# EAGLE design SC16IS740v4 (EAGLE 7.3.0)
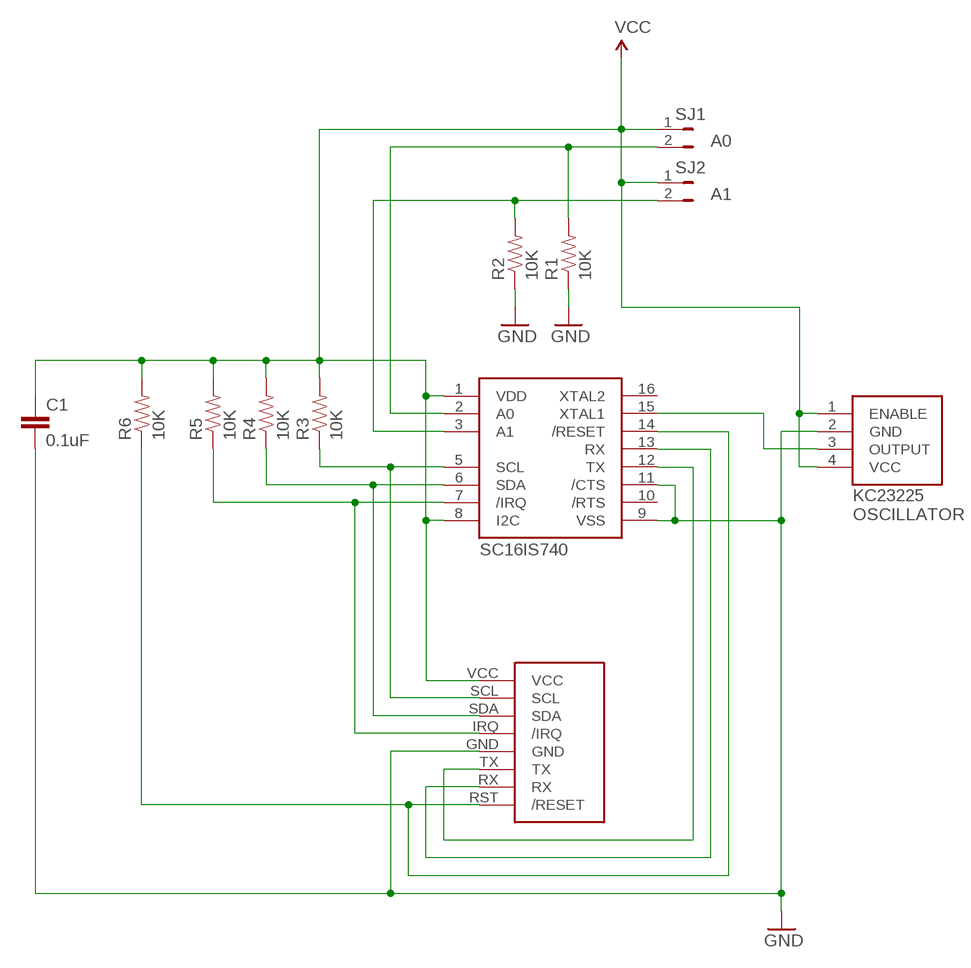
[diagram p0: schematic, sheet 1]

## Parts
C1  0.1uF  0.1UF-25V-5%(0603)  [0603-CAP]
R1  10K  10KOHM-1/10W-1%(0603)0603  [0603-RES]
R2  10K  10KOHM-1/10W-1%(0603)0603  [0603-RES]
R3  10K  10KOHM-1/10W-1%(0603)0603  [0603-RES]
R4  10K  10KOHM-1/10W-1%(0603)0603  [0603-RES]
R5  10K  10KOHM-1/10W-1%(0603)0603  [0603-RES]
R6  10K  10KOHM-1/10W-1%(0603)0603  [0603-RES]
SJ1  JUMPER-PTH-2-NO  [PTH-JUMPER-2-NO_NO_SILK]
SJ2  JUMPER-PTH-2-NO  [PTH-JUMPER-2-NO_NO_SILK]
U$1  SC16IS740  [SC16IS740]
U$2  HEADER-SC16IS740-NOFLOW  [HEADER-SC16IS740-NOFLOW]
U$3  OSC-KC3225K  [OSC-KC3225K]

## Nets
/IRQ: R5.1 U$1.7(/IRQ) U$2.IRQ(/IRQ)
/RESET: R6.1 U$1.14(/RESET) U$2.RST(/RESET)
A0: R1.2 SJ1.2 U$1.2(A0)
A1: R2.2 SJ2.2 U$1.3(A1)
GND: C1.2 R1.1 R2.1 U$1.9(VSS) U$1.11(/CTS) U$2.GND U$3.2(GND)
N$1: U$1.15(XTAL1) U$3.3(OUTPUT)
RX: U$1.13(RX) U$2.RX
SCL: R3.1 U$1.5(SCL) U$2.SCL
SDA: R4.1 U$1.6(SDA) U$2.SDA
TX: U$1.12(TX) U$2.TX
VCC: C1.1 R3.2 R4.2 R5.2 R6.2 SJ1.1 SJ2.1 U$1.1(VDD) U$1.8(I2C) U$2.VCC U$3.1(ENABLE) U$3.4(VCC)
Unconnected: U$1.10(/RTS) U$1.16(XTAL2)

## Notes on the sheet
- KC23225
  OSCILLATOR
- SC16IS740

## Library data of the parts
C1 = SparkFun-Capacitors:0.1UF-25V-5%(0603): CAP-08604; PROD_ID: CAP-08604
R1-R6 = SparkFun-Resistors:10KOHM-1/10W-1%(0603): RES-00824; PROD_ID: RES-00824
SJ1 SJ2 = rickk2:JUMPER-PTH-2-NO
U$1 = rickk2:SC16IS740
U$2 = rickk2:HEADER-SC16IS740-NOFLOW
U$3 = rickk2:OSC-KC3225K

## Board
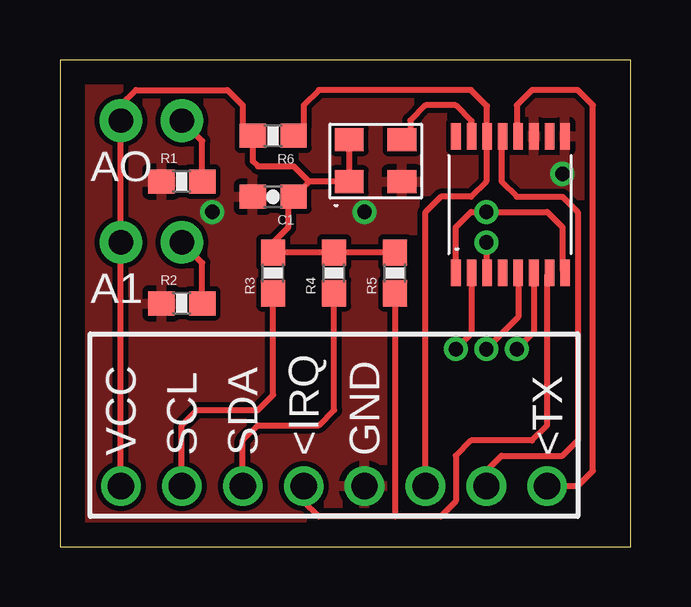
[diagram p1: board, top side]
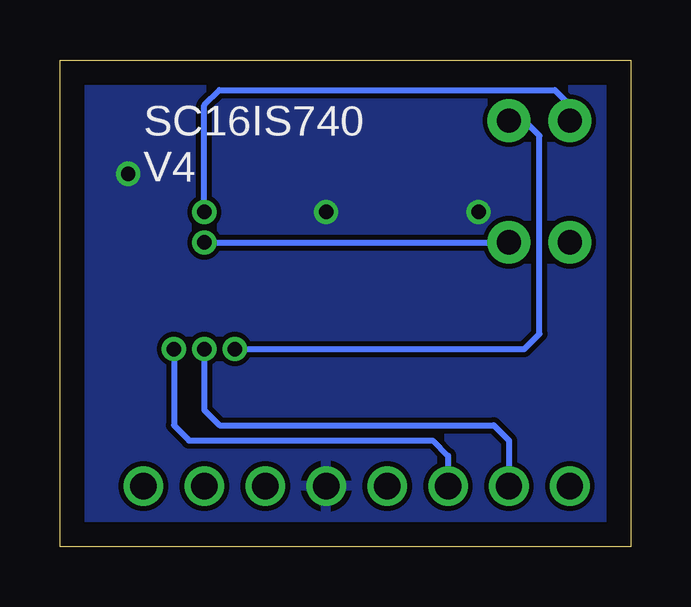
[diagram p2: board, bottom side, seen from below]

Size 23.8 x 20.31 mm. Coordinates in mm from the lower left corner, seen from the top.
Outline: 0,0 23.8,0 23.8,20.31 0,20.31 0,0
Copper layers (1*16): Top 0.035mm / dielectric 1.5mm / Bottom 0.035mm
Design rules "default": minimum track width 10mil, minimum drill 24mil, track to track 8mil, track to pad 8mil, pad to pad 8mil, via to via 8mil, smd to smd 8mil, copper to edge 40mil, drill to drill 8mil, minimum pad ring 10mil, minimum via ring 8mil, stop-mask expansion 4mil, vias tented up to drill 0mil, thermal gap 10mil

### Footprints (pad centres in the part's own frame; a part is rotated, then mirrored left to right if it is on the bottom)
0603-CAP = smd 1.1 x 1: 1 -0.85,0; 2 0.85,0
0603-RES = smd 1.1 x 1: 1 -0.85,0; 2 0.85,0
PTH-JUMPER-2-NO_NO_SILK = drill 1.016 pad 1.778: 1 -1.27,0; 2 1.27,0
SC16IS740 = smd 0.4 x 1.1: 1 0,0; 2 0.65,0; 3 1.3,0; 4 1.95,0; 5 2.6,0; 6 3.25,0; 7 3.9,0; 8 4.55,0; 9 4.55,5.7; 10 3.9,5.7; 11 3.25,5.7; 12 2.6,5.7; 13 1.95,5.7; 14 1.3,5.7; 15 0.65,5.7; 16 0,5.7
HEADER-SC16IS740-NOFLOW = drill 1.1: GND 10.16,0; IRQ 7.62,0; RST 12.7,0; RX 15.24,0; SCL 2.54,0; SDA 5.08,0; TX 17.78,0; VCC 0,0
OSC-KC3225K = smd 1.2 x 0.95: 1 0,0; 2 2.2,0; 3 2.2,1.75; 4 0,1.75

### Placement (x,y rotation side)
C1  8.89,14.61 180 top
R1  5.08,15.24 0 top
R2  5.08,10.16 0 top
R3  8.89,11.43 90 top
R4  11.43,11.43 90 top
R5  13.97,11.43 90 top
R6  8.89,17.14 180 top
SJ1  3.81,17.78 0 top
SJ2  3.81,12.7 0 top
U$1  16.51,11.43 0 top
U$2  2.54,2.54 0 top
U$3  12.06,15.24 0 top

### Tracks (layer width: path | path; a pad name or v marks a point on that pad's centre or on a via)
/IRQ
  Top 0.254: U$1.7 20.32,11.34 20.32,5.08 19.68,4.45 17.14,4.45 16.51,3.81 16.51,1.91 15.88,1.27 13.97,1.27 | R5.1 13.97,1.27 | 13.97,1.27 10.79,1.27 10.16,1.91 U$2.IRQ
/RESET
  Top 0.254: R6.1 10.16,17.57 10.16,18.41 10.79,19.05 17.14,19.05 17.81,18.39 U$1.14 17.78,17.1 17.78,15.24 17.14,14.61 15.88,14.61 15.24,13.97 U$2.RST
A0  (via drill 0.6)
  Top 0.254: R1.2 5.93,16.93 SJ1.2 | U$1.2 17.16,8.9 v16.51,8.26
  Bottom 0.254: v16.51,8.26 4.45,8.26 3.81,8.89 3.81,17.14 4.45,17.78 SJ1.2
A1  (via drill 0.6)
  Top 0.254: R2.2 5.93,11.85 SJ2.2 | U$1.3 17.81,12.67 v17.78,12.7
  Bottom 0.254: v17.78,12.7 SJ2.2
GND  (via drill 0.6)
  other vias: 12.7,13.97 6.35,13.97 20.95,15.56
  pour Bottom: 0,0 0,21.59 22.86,21.59 22.86,0
  pour Top: 0,0 0,21.59 22.86,21.59 22.86,0
N$1
  Top 0.254: U$1.15 17.16,17.77 16.51,18.41 15.24,18.41 14.61,17.78 14.61,17.33 U$3.3
RX
  Top 0.254: U$2.RX 17.78,3.17 18.41,3.81 20.95,3.81 21.59,4.45 21.59,13.97 20.95,14.61 19.05,14.61 18.41,15.24 18.41,17.09 U$1.13
SCL  (via drill 0.6)
  Top 0.254: U$2.SCL 5.08,5.08 5.71,5.71 8.26,5.71 8.89,6.35 R3.1 | 19.05,11.43 U$1.5 19.11,9.59 v17.78,8.26
  Bottom 0.254: U$2.SCL 5.08,4.45 5.71,5.08 17.14,5.08 17.78,5.71 v17.78,8.26
SDA  (via drill 0.6)
  Top 0.254: U$2.SDA 7.62,4.45 8.26,5.08 10.79,5.08 11.43,5.71 R4.1 | U$1.6 19.76,8.96 v19.05,8.26
  Bottom 0.254: v19.05,8.26 19.05,5.08 18.41,4.45 8.26,4.45 7.62,3.81 U$2.SDA
TX
  Top 0.254: U$2.TX 21.59,2.54 22.23,3.17 22.23,18.41 21.59,19.05 19.68,19.05 19.05,18.41 19.05,17.19 U$1.12
VCC  (via drill 0.6)
  Top 0.254: U$2.VCC SJ2.1 SJ1.1 2.54,18.41 3.17,19.05 6.99,19.05 7.62,18.41 7.62,17.57 R6.2 8.04,16.09 8.26,15.88 9.74,15.88 10.38,15.24 | U$3.4 U$3.1 10.38,15.24 | 10.38,15.24 C1.1 9.53,14.39 9.53,13.34 8.89,12.7 R3.2 R4.2 R5.2 | U$1.1 16.51,13.34 17.14,13.97 v17.78,13.97 20.32,13.97 20.95,13.34 20.95,11.54 U$1.8
  Bottom 0.254: v17.78,13.97 17.78,18.41 17.14,19.05 3.17,19.05 2.54,18.41 SJ1.1

### Text on the board
tPlace: AO | A1
bPlace: SC16IS740 / V4